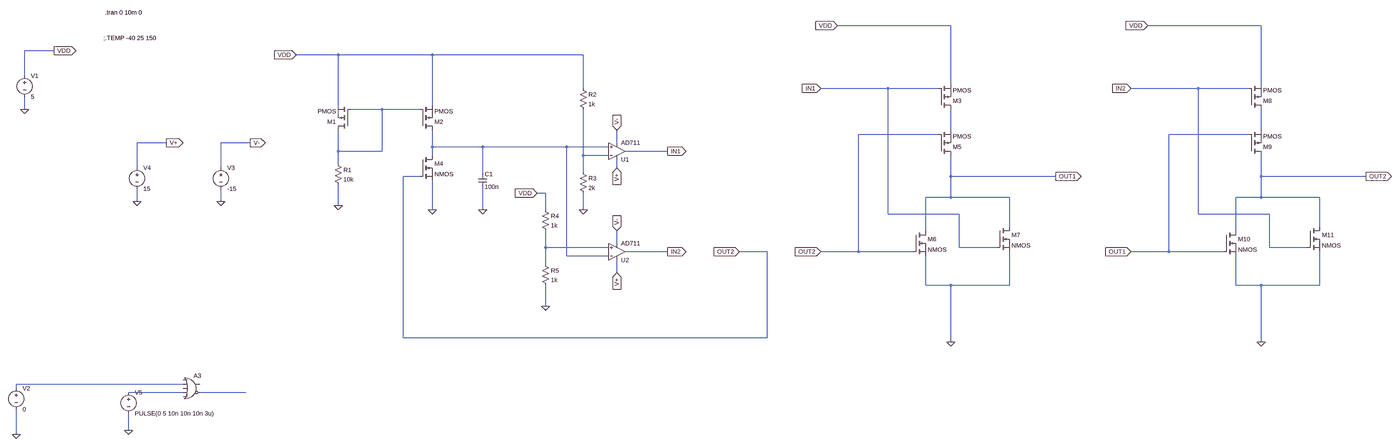
[diagram p0: schematic Report5.asc, whole sheet]
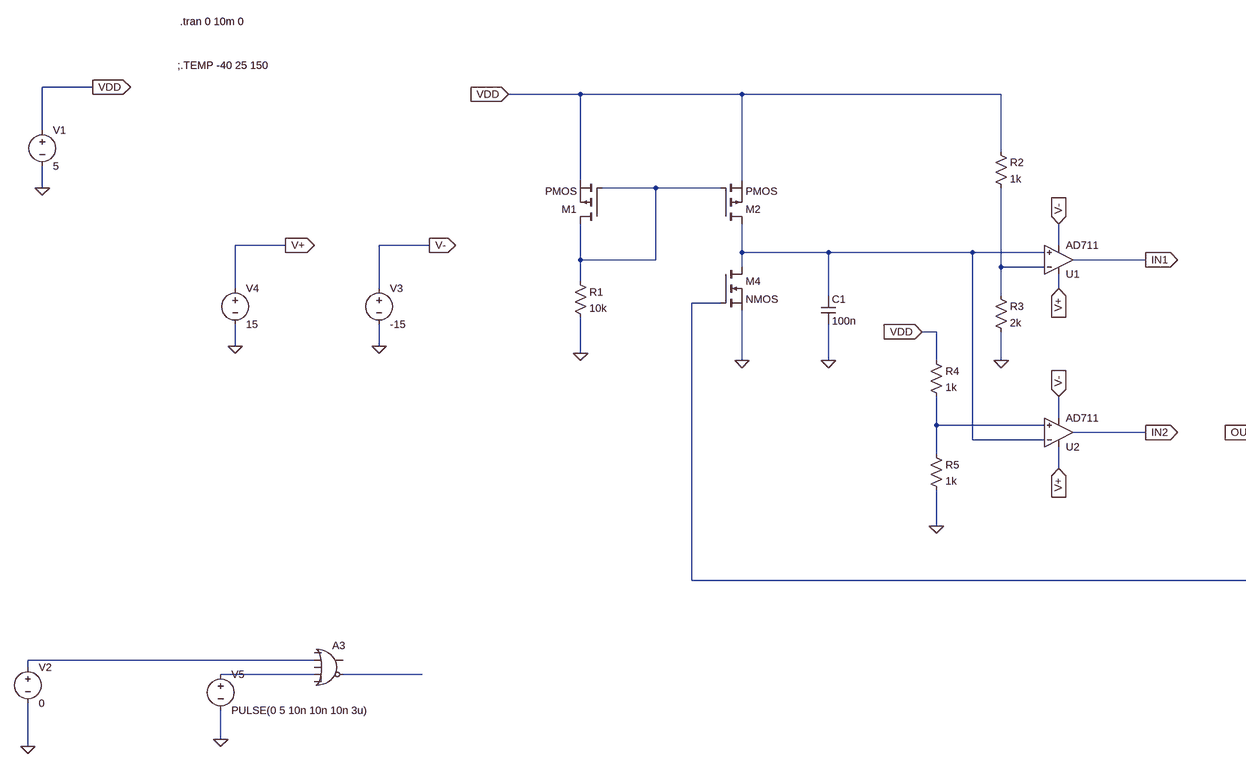
[diagram p1: schematic Report5.asc, part, row 1 of 1, column 1 of 2]
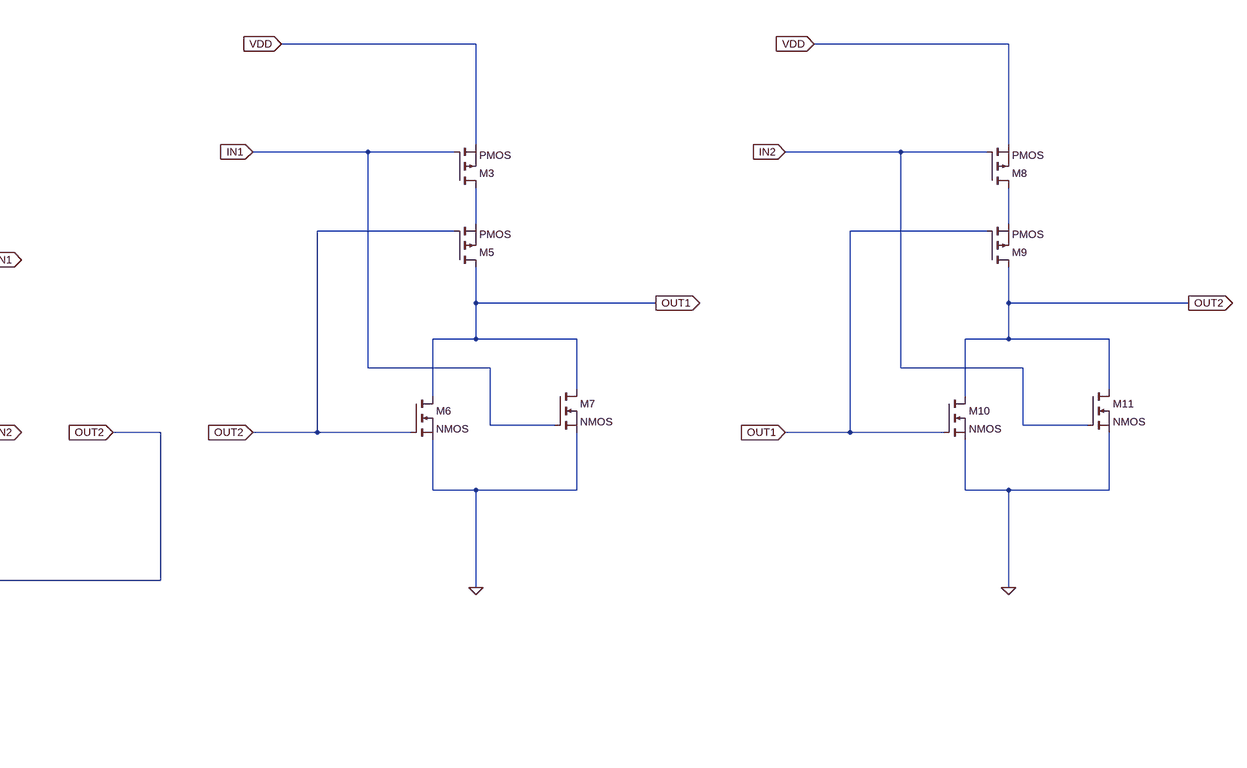
[diagram p2: schematic Report5.asc, part, row 1 of 1, column 2 of 2]
Report5.asc, the LTspice schematic file:
Version 4
SHEET 1 5052 1796
WIRE 2736 -176 2304 -176
WIRE 3920 -176 3488 -176
WIRE -944 -80 -1056 -80
WIRE 144 -64 -16 -64
WIRE 528 -64 144 -64
WIRE 1104 -64 528 -64
WIRE -1056 16 -1056 -80
WIRE 2736 48 2736 -176
WIRE 3920 48 3920 -176
WIRE 1104 64 1104 -64
WIRE 2496 64 2240 64
WIRE 2688 64 2496 64
WIRE 3680 64 3424 64
WIRE 3872 64 3680 64
WIRE 144 128 144 -64
WIRE 528 128 528 -64
WIRE -1056 144 -1056 96
WIRE 336 144 192 144
WIRE 480 144 336 144
WIRE 2736 224 2736 144
WIRE 3920 224 3920 144
WIRE 2688 240 2384 240
WIRE 3872 240 3568 240
WIRE -512 272 -624 272
WIRE -192 272 -304 272
WIRE 1232 272 1232 224
WIRE 528 288 528 224
WIRE 720 288 528 288
WIRE 1040 288 720 288
WIRE 1200 288 1040 288
WIRE 144 304 144 224
WIRE 336 304 336 144
WIRE 336 304 144 304
WIRE 1472 304 1264 304
WIRE 528 320 528 288
WIRE 1104 320 1104 144
WIRE 1200 320 1104 320
WIRE 144 352 144 304
WIRE -624 368 -624 272
WIRE -304 368 -304 272
WIRE 1232 368 1232 336
WIRE 720 384 720 288
WIRE 1104 384 1104 320
WIRE 480 400 416 400
WIRE 2736 400 2736 320
WIRE 3136 400 2736 400
WIRE 3920 400 3920 320
WIRE 4320 400 3920 400
WIRE 960 464 928 464
WIRE 2736 480 2736 400
WIRE 2736 480 2640 480
WIRE 2960 480 2736 480
WIRE 3920 480 3920 400
WIRE 3920 480 3824 480
WIRE 4144 480 3920 480
WIRE -624 496 -624 448
WIRE -304 496 -304 448
WIRE 144 512 144 432
WIRE 528 528 528 416
WIRE 720 528 720 448
WIRE 960 528 960 464
WIRE 1104 528 1104 464
WIRE 2496 544 2496 64
WIRE 2768 544 2496 544
WIRE 3680 544 3680 64
WIRE 3952 544 3680 544
WIRE 2960 592 2960 480
WIRE 4144 592 4144 480
WIRE 2640 608 2640 480
WIRE 3824 608 3824 480
WIRE 1232 656 1232 608
WIRE 960 672 960 608
WIRE 1200 672 960 672
WIRE 2768 672 2768 544
WIRE 2912 672 2768 672
WIRE 3952 672 3952 544
WIRE 4096 672 3952 672
WIRE 1472 688 1264 688
WIRE 1920 688 1808 688
WIRE 2384 688 2384 240
WIRE 2384 688 2240 688
WIRE 2592 688 2384 688
WIRE 3568 688 3568 240
WIRE 3568 688 3424 688
WIRE 3776 688 3568 688
WIRE 1040 704 1040 288
WIRE 1200 704 1040 704
WIRE 960 736 960 672
WIRE 1232 768 1232 720
WIRE 2640 816 2640 704
WIRE 2736 816 2640 816
WIRE 2960 816 2960 688
WIRE 2960 816 2736 816
WIRE 3824 816 3824 704
WIRE 3920 816 3824 816
WIRE 4144 816 4144 688
WIRE 4144 816 3920 816
WIRE 960 896 960 816
WIRE 416 1040 416 400
WIRE 1920 1040 1920 688
WIRE 1920 1040 416 1040
WIRE 2736 1056 2736 816
WIRE 3920 1056 3920 816
WIRE -448 1584 -1088 1584
WIRE -1088 1600 -1088 1584
WIRE -448 1616 -656 1616
WIRE -208 1616 -384 1616
WIRE -656 1760 -656 1696
WIRE -1088 1776 -1088 1680
FLAG -16 -64 VDD
IOPIN -16 -64 In
FLAG 144 512 0
FLAG -1056 144 0
FLAG -944 -80 VDD
IOPIN -944 -80 Out
FLAG 720 528 0
FLAG 528 528 0
FLAG 1104 528 0
FLAG 1232 368 V+
IOPIN 1232 368 In
FLAG 1232 224 V-
IOPIN 1232 224 In
FLAG 1232 768 V+
IOPIN 1232 768 In
FLAG 1232 608 V-
IOPIN 1232 608 In
FLAG 960 896 0
FLAG 928 464 VDD
IOPIN 928 464 In
FLAG -304 496 0
FLAG -192 272 V-
IOPIN -192 272 Out
FLAG -624 496 0
FLAG -512 272 V+
IOPIN -512 272 Out
FLAG -656 1760 0
FLAG -1088 1776 0
FLAG 2304 -176 VDD
IOPIN 2304 -176 In
FLAG 2736 1056 0
FLAG 3136 400 OUT1
IOPIN 3136 400 Out
FLAG 1472 304 IN1
IOPIN 1472 304 Out
FLAG 2240 688 OUT2
IOPIN 2240 688 In
FLAG 2240 64 IN1
IOPIN 2240 64 In
FLAG 3488 -176 VDD
IOPIN 3488 -176 In
FLAG 3920 1056 0
FLAG 4320 400 OUT2
IOPIN 4320 400 Out
FLAG 3424 688 OUT1
IOPIN 3424 688 In
FLAG 3424 64 IN2
IOPIN 3424 64 In
FLAG 1472 688 IN2
IOPIN 1472 688 Out
FLAG 1808 688 OUT2
IOPIN 1808 688 In
SYMBOL pmos 192 224 R180
SYMATTR InstName M1
SYMBOL pmos 480 224 M180
SYMATTR InstName M2
SYMBOL nmos 480 320 R0
SYMATTR InstName M4
SYMBOL voltage -1056 0 R0
WINDOW 123 0 0 Left 0
WINDOW 39 0 0 Left 0
SYMATTR InstName V1
SYMATTR Value 5
SYMBOL cap 704 384 R0
SYMATTR InstName C1
SYMATTR Value 100n
SYMBOL res 128 336 R0
SYMATTR InstName R1
SYMATTR Value 10k
SYMBOL Opamps\\AD711 1232 368 M180
SYMATTR InstName U1
SYMBOL Opamps\\AD711 1232 752 M180
SYMATTR InstName U2
SYMBOL res 1088 48 R0
SYMATTR InstName R2
SYMATTR Value 1k
SYMBOL res 1088 368 R0
SYMATTR InstName R3
SYMATTR Value 2k
SYMBOL res 944 512 R0
SYMATTR InstName R4
SYMATTR Value 1k
SYMBOL res 944 720 R0
SYMATTR InstName R5
SYMATTR Value 1k
SYMBOL voltage -304 352 R0
WINDOW 123 0 0 Left 0
WINDOW 39 0 0 Left 0
SYMATTR InstName V3
SYMATTR Value -15
SYMBOL voltage -624 352 R0
WINDOW 123 0 0 Left 0
WINDOW 39 0 0 Left 0
SYMATTR InstName V4
SYMATTR Value 15
SYMBOL Digital\\or -416 1536 R0
SYMATTR InstName A3
SYMBOL voltage -1088 1584 R0
WINDOW 123 0 0 Left 0
WINDOW 39 0 0 Left 0
SYMATTR InstName V2
SYMATTR Value 0
SYMBOL voltage -656 1600 R0
WINDOW 123 0 0 Left 0
WINDOW 39 0 0 Left 0
SYMATTR InstName V5
SYMATTR Value PULSE(0 5 10n 10n 10n 3u)
SYMBOL pmos 2688 144 M180
SYMATTR InstName M3
SYMBOL pmos 2688 320 M180
SYMATTR InstName M5
SYMBOL nmos 2592 608 R0
SYMATTR InstName M6
SYMBOL nmos 2912 592 R0
SYMATTR InstName M7
SYMBOL pmos 3872 144 M180
SYMATTR InstName M8
SYMBOL pmos 3872 320 M180
SYMATTR InstName M9
SYMBOL nmos 3776 608 R0
SYMATTR InstName M10
SYMBOL nmos 4096 592 R0
SYMATTR InstName M11
TEXT -752 -128 Left 2 !;.TEMP -40 25 150
TEXT -746 -226 Left 2 !.tran 0 10m 0

The netlist it stands for:
* Report5.asc
M1 N001 N001 VDD VDD PMOS
M2 N004 N001 VDD VDD PMOS
M4 N004 OUT2 0 0 NMOS
V1 VDD 0 5
C1 N004 0 100n
R1 N001 0 10k
XU1 N004 N005 V+ V- IN1 AD712  ; AD711, pins In+ In- V+ V- OUT
XU2 N006 N004 V+ V- IN2 AD712  ; AD711, pins In+ In- V+ V- OUT
R2 VDD N005 1k
R3 N005 0 2k
R4 VDD N006 1k
R5 N006 0 1k
V3 V- 0 -15
V4 V+ 0 15
A3 0 N007 0 N008 0 N009 0 0 OR
V2 N007 0 0
V5 N008 0 PULSE(0 5 10n 10n 10n 3u)
M3 N002 IN1 VDD VDD PMOS
M5 OUT1 OUT2 N002 N002 PMOS
M6 OUT1 OUT2 0 0 NMOS
M7 OUT1 IN1 0 0 NMOS
M8 N003 IN2 VDD VDD PMOS
M9 OUT2 OUT1 N003 N003 PMOS
M10 OUT2 OUT1 0 0 NMOS
M11 OUT2 IN2 0 0 NMOS
.model NMOS NMOS
.model PMOS PMOS
.lib standard.mos
;.TEMP -40 25 150
.tran 0 10m 0
.lib ADI1.lib
.backanno
.end